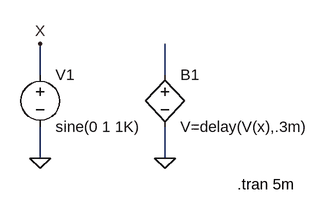
[diagram p0: schematic delay.asc]
delay.asc, the LTspice schematic file:
Version 4
SHEET 1 880 680
WIRE 48 400 48 352
WIRE 48 272 48 224
WIRE 240 224 240 272
WIRE 240 352 240 400
FLAG 240 400 0
FLAG 48 400 0
FLAG 48 224 X
SYMBOL bv 240 256 R0
SYMATTR InstName B1
SYMATTR Value V=delay(V(x),.3m)
SYMBOL voltage 48 256 R0
SYMATTR InstName V1
SYMATTR Value sine(0 1 1K)
TEXT 352 440 Left 0 !.tran 5m

The netlist it stands for:
* delay.asc
B1 N001 0 V=delay(V(x),.3m)
V1 X 0 sine(0 1 1K)
.tran 5m
.backanno
.end